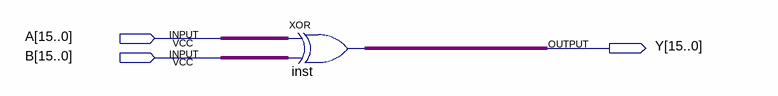
[diagram p0: schematic sheet]
// Quartus schematic XOR_16Bit.bdf as structural Verilog: 1 symbols, 3 pins
module XOR_16Bit (
  input  [15:0] A,
  input  [15:0] B,
  output [15:0] Y
);

  assign Y = A ^ B;  // XOR inst, 16 bits wide
endmodule
